# Altium project Ultrasonic extern.PrjPcb
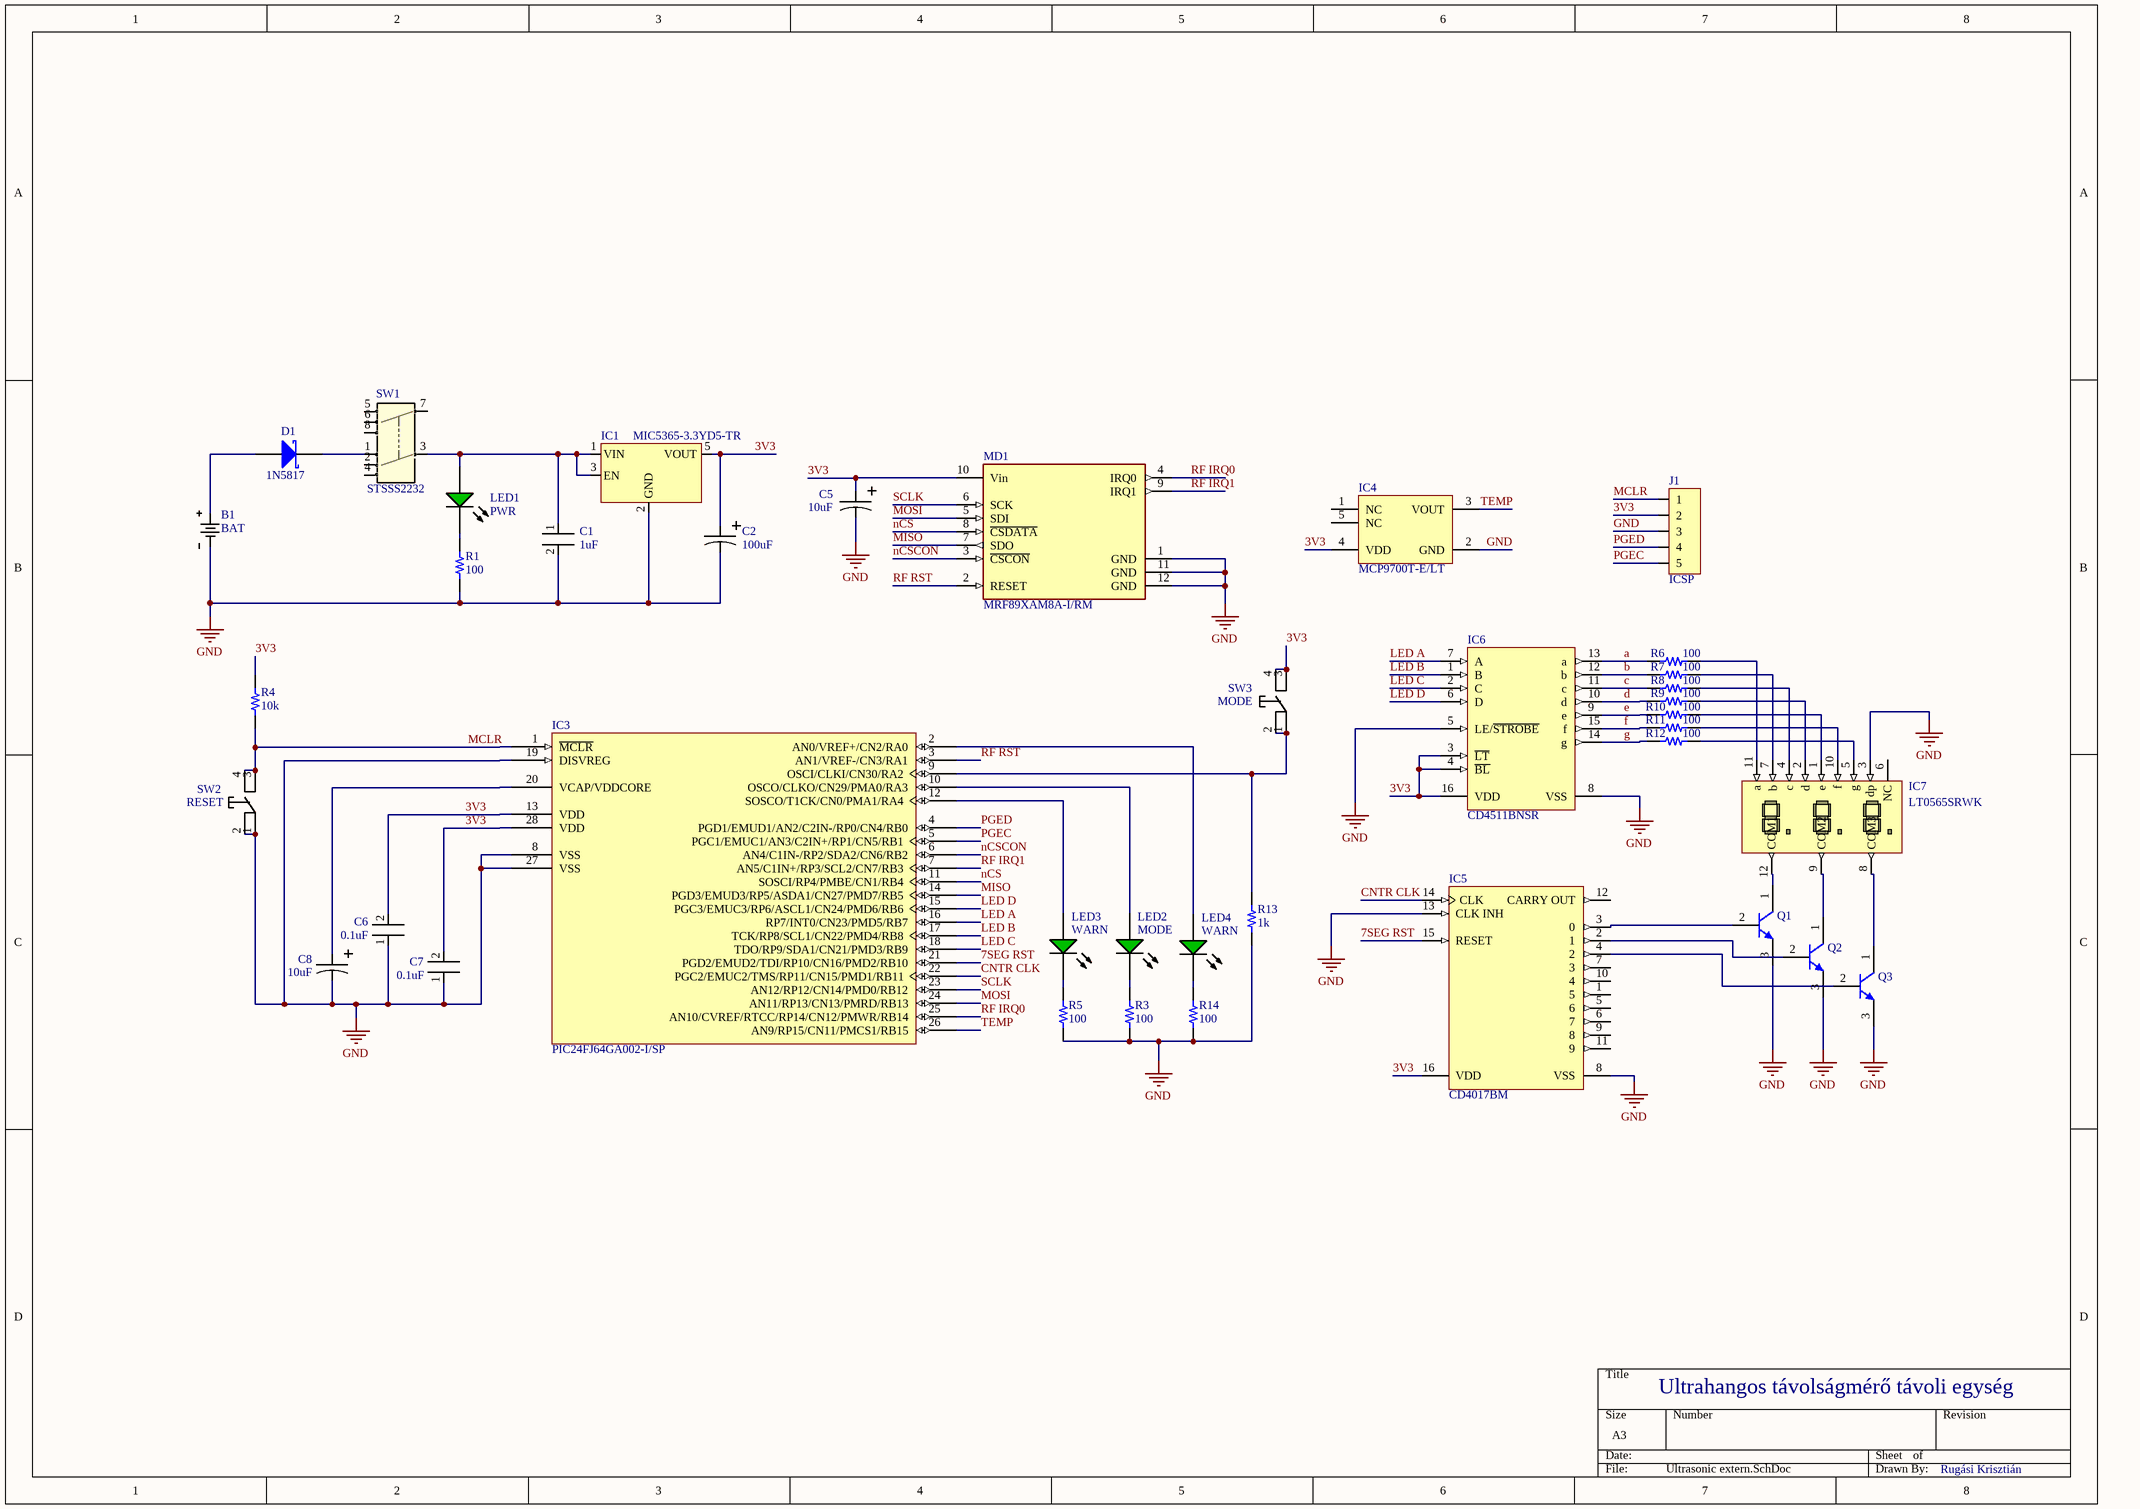
[diagram p0: Ultrasonic extern.SchDoc]
1 sheet, 39 parts. Net scope: global (net labels, ports and power ports of the same name join across sheets).
Board file: Ultrasonic extern.PcbDoc

## Sheet Ultrasonic extern.SchDoc: Ultrahangos távolságmérő távoli egység
size A3; Author: Rugási Krisztián; Engineer: Rugási Krisztián; DocumentNumber: 2; Revision: 1; SheetNumber: 1; SheetTotal: 1

### Parts
B1  BAT  [MP000342]
C1  1uF  [1206]
C2  100uF  [THT CAP POL 5mm]
C5  10uF  [THT CAP POL 5mm]
C6  0.1uF  [1206]
C7  0.1uF  [1206]
C8  10uF  [THT CAP POL 5mm]
D1  1N5817  [DIOD-DO-41-P-2]
IC1  MIC5365-3.3YD5-TR  [TSOT-23-5]
IC3  PIC24FJ64GA002-I/SP  [SPDIP300-SP28]
IC4  MCP9700T-E/LT  [SC70-LT5_M]
IC5  CD4017BM  [D0016A_N]
IC6  CD4511BNSR  [NS0016A_L]
IC7  LT0565SRWK  [7 segment LED display]
J1  ICSP  [5 PIN CON]
LED1  PWR  [LED-2P-2.54-3MM_V]
LED2  MODE  [LED-2P-2.54-3MM_V]
LED3  WARN  [LED-2P-2.54-3MM_V]
LED4  WARN  [LED-2P-2.54-3MM_V]
MD1  MRF89XAM8A-I/RM  [FP-MRF89XAM8A-I-RM-0]
Q1  BC548CG  [ONSC-TO-92-3-29-11]  (value not drawn)
Q2  BC548CG  [ONSC-TO-92-3-29-11]  (value not drawn)
Q3  BC548CG  [ONSC-TO-92-3-29-11]  (value not drawn)
R1  100  [RES 1206_3216]
R3  100  [RES 1206_3216]
R4  10k  [RES 1206_3216]
R5  100  [RES 1206_3216]
R6  100  [RES 1206_3216]
R7  100  [RES 1206_3216]
R8  100  [RES 1206_3216]
R9  100  [RES 1206_3216]
R10  100  [RES 1206_3216]
R11  100  [RES 1206_3216]
R12  100  [RES 1206_3216]
R13  1k  [RES 1206_3216]
R14  100  [RES 1206_3216]
SW1  STSSS2232  [STSSS2232]
SW2  RESET  [FSM4JH]
SW3  MODE  [FSM4JH]

### Nets
GND: B1.1(-) C1.2 C2.2 C5.2 C6.1 C7.1 C8.2 IC1.2(GND) IC3.8(VSS) IC3.19(DISVREG) IC3.27(VSS) IC4.2(GND) IC5.8(VSS) IC5.13(CLK_INH) IC6.5(LE/~{STROBE}) IC6.8(VSS) IC7.3(dp) J1.3 MD1.1(GND) MD1.11(GND) MD1.12(GND) Q1.3(E) Q2.3(E) Q3.3(E) R1.1 R3.1 R5.1 R13.1 R14.1 SW2.1 SW2.2
3V3: C2.1 C5.1 C6.2 C7.2 IC1.5(VOUT) IC3.13(VDD) IC3.28(VDD) IC4.4(VDD) IC5.16(VDD) IC6.3(~{LT}) IC6.4(~{BL}) IC6.16(VDD) J1.2 MD1.10(Vin) R4.2 SW3.3 SW3.4
7SEG RST: IC3.21(PGD2/EMUD2/TDI/RP10/CN16/PMD2/RB10) IC5.15(RESET)
a: IC6.13(a) R6.2
b: IC6.12(b) R7.2
c: IC6.11(c) R8.2
CNTR CLK: IC3.22(PGC2/EMUC2/TMS/RP11/CN15/PMD1/RB11) IC5.14(CLK)
d: IC6.10(d) R9.2
e: IC6.9(e) R10.2
f: IC6.15(f) R11.2
g: IC6.14(g) R12.2
LED A: IC3.16(RP7/INT0/CN23/PMD5/RB7) IC6.7(A)
LED B: IC3.17(TCK/RP8/SCL1/CN22/PMD4/RB8) IC6.1(B)
LED C: IC3.18(TDO/RP9/SDA1/CN21/PMD3/RB9) IC6.2(C)
LED D: IC3.15(PGC3/EMUC3/RP6/ASCL1/CN24/PMD6/RB6) IC6.6(D)
MCLR: IC3.1(~{MCLR}) J1.1 R4.1 SW2.3 SW2.4
MISO: IC3.14(PGD3/EMUD3/RP5/ASDA1/CN27/PMD7/RB5) MD1.7(SDO)
MOSI: IC3.24(AN11/RP13/CN13/PMRD/RB13) MD1.5(SDI)
nCS: IC3.11(SOSCI/RP4/PMBE/CN1/RB4) MD1.8(~{CSDATA})
nCSCON: IC3.6(AN4/C1IN-/RP2/SDA2/CN6/RB2) MD1.3(~{CSCON})
PGEC: IC3.5(PGC1/EMUC1/AN3/C2IN+/RP1/CN5/RB1) J1.5
PGED: IC3.4(PGD1/EMUD1/AN2/C2IN-/RP0/CN4/RB0) J1.4
RF IRQ0: IC3.25(AN10/CVREF/RTCC/RP14/CN12/PMWR/RB14) MD1.4(IRQ0)
RF IRQ1: IC3.7(AN5/C1IN+/RP3/SCL2/CN7/RB3) MD1.9(IRQ1)
RF RST: IC3.3(AN1/VREF-/CN3/RA1) MD1.2(RESET)
SCLK: IC3.23(AN12/RP12/CN14/PMD0/RB12) MD1.6(SCK)
TEMP: IC3.26(AN9/RP15/CN11/PMCS1/RB15) IC4.3(VOUT)
NetB1_2: B1.2(+) D1.1(A)
NetC1_1: C1.1 IC1.1(VIN) IC1.3(EN) LED1.1(A) SW1.3
NetC8_1: C8.1 IC3.20(VCAP/VDDCORE)
NetD1_2: D1.2(K) SW1.1
NetIC3_2: IC3.2(AN0/VREF+/CN2/RA0) LED4.1(A)
NetIC3_9: IC3.9(OSCI/CLKI/CN30/RA2) R13.2 SW3.1 SW3.2
NetIC3_10: IC3.10(OSCO/CLKO/CN29/PMA0/RA3) LED2.1(A)
NetIC3_12: IC3.12(SOSCO/T1CK/CN0/PMA1/RA4) LED3.1(A)
NetIC5_2: IC5.2(1) Q2.2(B)
NetIC5_3: IC5.3(0) Q1.2(B)
NetIC5_4: IC5.4(2) Q3.2(B)
NetIC7_1: IC7.1(e) R10.1
NetIC7_2: IC7.2(d) R9.1
NetIC7_4: IC7.4(c) R8.1
NetIC7_5: IC7.5(g) R12.1
NetIC7_7: IC7.7(b) R7.1
NetIC7_8: IC7.8(COM3) Q3.1(C)
NetIC7_9: IC7.9(COM2) Q2.1(C)
NetIC7_10: IC7.10(f) R11.1
NetIC7_11: IC7.11(a) R6.1
NetIC7_12: IC7.12(COM1) Q1.1(C)
NetLED1_2: LED1.2(K) R1.2
NetLED2_2: LED2.2(K) R3.2
NetLED3_2: LED3.2(K) R5.2
NetLED4_2: LED4.2(K) R14.2

Not connected (* = marked no-connect by the designer): IC4 1(NC) 5(NC); IC5 1(5) 5(6) 6(7) 7(3) 9(8) 10(4) 11(9) 12(CARRY_OUT); IC7 6(NC); SW1 2 4 5 6 7 8

### Notes on the sheet
- Ultrahangos távolságmérő távoli egység
- Rugási Krisztián

### Library data of the parts
B1 = BAT: Battery holder 3xAAA
C1 C6 C7 = CAP: Capacitor ceramic
C2 C5 C8 = CAP POL: aluminium electrolytic capacitor
D1 = CMP-2000-05521-1: Schottky Barrier Rectifier, 1 A, 20 V, -65 to 125 degC, 2-Pin DO-41, RoHS, Tape and Reel; Manufacturer: DiodesIncorporated; Vrrm - Repetitive Reverse Voltage: 20V; If - Forward Current: 1A; Configuration: Single; Unit Weight: 0.010582oz; Type: SchottkyDiode; Ifsm - Forward Surge Current: 25A; Vf - Forward Voltage: 0.75Vat3A; Ir - Reverse Current: 1000uA; Technology: Si; Length: 5.21mm; Product: SchottkyRectifiers; Package Reference: DO-41-P-2; Package / Case: DO-41; Datasheet URL: http://www.diodes.com/_files/datasheets/ds23001.pdf; Operating Temperature Range: -65Cto+125C; Mounting Style: ThroughHole; Manufacturer URL: http://www.diodes.com/; Series: 1N58; Minimum Operating Temperature: -65C; Height: 2.72mm; Brand: DiodesIncorporated; Maximum Operating Temperature: +125C; Datasheet Version: Rev. 8-2, 05/2009; Factory Pack Quantity: 5000; Width: 2.72mm; RoHS: True; Product Category: SchottkyDiodes&Rectifiers; Package Description: 2-Pin Through Hole Device, Body 4.635 x 2.36 mm, Pin Spacing 7.85 mm; Packaging: Reel; Termination Style: ThroughHole; Mounting Technology: ThroughHole
IC1 = MIC5365-3.3YD5-TR: LDO Voltage regulator 2.5V-5.5V in 3.3V out
IC3 = CMP-0046-00003-2: General Purpose 16-Bit Flash Microcontroller, 64KB Flash, 8KB SRAM, 28-Pin SPDIP, Industrial Temperature; RevisionNote: Component URLs added.; ComponentLink2URL: http://www.microchip.com/stellent/groups/techpub_sg/documents/packagingspec/en012702.pdf; ComponentLink2Description: Packaging Specification; PackageDescription: 28-Lead Skinny Plastic Dual In-Line (SP) - 300 mil Body [SPDIP]; PackageReference: SPDIP300-SP28; DatasheetVersion: revD, Feb-2010; PackageVersion: revBB, Aug-2009; ComponentLink3Description: Microchip.com Home; ComponentLink3URL: http://www.microchip.com/; ComponentLink1Description: Datasheet; ComponentLink1URL: http://ww1.microchip.com/downloads/en/DeviceDoc/39881D.pdf
IC4 = CMP-0192-00174-1: Low-Power Linear Active Thermistor IC, 5-Pin SC-70, Extended Temperature, Tape and Reel; PackageDescription: 5-Lead Plastic Small Outline Transistor (LT) [SC70]; DatasheetVersion: revE, Apr-2009; PackageVersion: revBB, Aug-2009; PackageReference: SC70-LT5; Code_IPC: SOT353-5
IC5 = CMP-1623-00071-2: CMOS Decade Counter with 10 Decoded Outputs, D0016A, TUBE; Manufacturer: Texas Instruments; Voltage(Nom)(V): 10; VCC(Min)(V): 3; tpd @ Nom Voltage(Max)(ns): 270; Technology Family: CD4000; VCC(Max)(V): 18; ICC @ Nom Voltage(Max)(mA): 0.03; Schmitt Trigger: No; Inputs: 1; Rating: Military; F @ Nom Voltage(Max)(Mhz): 8; Output Drive (IOL/IOH)(Max)(mA): 1.5/-1.5; Generic Part Number: CD4017B; DatasheetVersion: SCHS027C; Type: Decade; PackageReference: D0016A; Operating Temperature Range(C): -55 to 125; Function: Counter; Bits(#): 10; Code_JEDEC: MS-012 variation AC; Output Type: CMOS; Input Type: CMOS
IC6 = CMP-0388-00338-2: CMOS BCD-to-7-Segment LED Latch / Decoder / Driver, 3 to 18 V, -55 to 125 degC, 16-pin SOP (NS16), Green (RoHS & no Sb/Br); Manufacturer: Texas Instruments; Vin(Max)(V): 18; SubFamily: Discrete Segment LED Driver; Rating: Military; Vin(Min)(V): 3; PackageReference: NS0016A; ComponentLink1Description: Manufacturer URL; DatasheetVersion: SCHS072B; PackageVersion: 4040062/C; PackageDescription: 16-Pin Plastic Small Outline, Body 10.20 x 5.30 mm, Pitch 1.27 mm; ComponentLink2URL: http://www.ti.com/general/docs/lit/getliterature.tsp?genericPartNumber=CD4511B&fileType=pdf; Mounting Technology: Surface Mount; ComponentLink3URL: http://www.ti.com/litv/pdf/msop002a; Eco-Plan: Green (RoHS & no Sb/Br); ComponentLink3Description: Package Specification; ComponentLink2Description: Datasheet; ComponentLink1URL: http://www.ti.com/; PartNumber: CD4511BNSR
IC7 = LT0565SRWK: 7 segment LED red display, 3 digit, common cathode, 2.5V forward, 20mA
J1 = 5 PIN CON: ICSP programming pins
LED1 LED2 = CMP-2000-05186-1: Green Diffused LED, 2.1 V, 20 mA forward, -40 to 85 degC, 2-Pin THD, RoHS; Manufacturer: Avago; Viewing Angle: 50deg; Number of LEDs: 1; Lens Appearance: ColoredDiffused; Peak Wavelength: 565nm; Dominant Wavelength/Color Temperature: 569nm; Mounting Orientation: TopMount; Rad Hard: No; Lens Shape Type: Circular; Type: Uni-Color; Intensity: 2.3mcd; Package: 2T-1; Packaging: Bulk; Pin Count: 2; Color: Green; Datasheet URL: https://datasheet.ciiva.com/11773/0900766b800204ad-11773539.pdf; Manufacturer URL: http://www.avagotech.com/; Category: LEDs; Mounting: ThroughHole; Datasheet Version: Jul-14
LED3 LED4 = CMP-2000-05186-1: Red Diffused LED, 2.1 V, 20 mA forward, -40 to 85 degC, 2-Pin THD, RoHS; Manufacturer: Avago; Viewing Angle: 50deg; Number of LEDs: 1; Lens Appearance: ColoredDiffused; Color: Green; Peak Wavelength: 565nm; Dominant Wavelength/Color Temperature: 569nm; Mounting Orientation: TopMount; Rad Hard: No; Lens Shape Type: Circular; Type: Uni-Color; Intensity: 2.3mcd; Package: 2T-1; Packaging: Bulk; Pin Count: 2; Datasheet URL: https://datasheet.ciiva.com/11773/0900766b800204ad-11773539.pdf; Manufacturer URL: http://www.avagotech.com/; Category: LEDs; Mounting: ThroughHole; Datasheet Version: Jul-14
MD1 = CMP-06331-000001-1: RF TXRX MOD ISM<1GHZ TRACE ANT; Manufacturer: Microchip; Bandwidth: 7MHz; Nominal Supply Current: 1.3mA; Data Rate: 40kbits/s; Max Supply Voltage: 3.6V; Interface: SPI; Transmitting Current: 25mA; Min Supply Voltage: 2.1V; Max Frequency: 870MHz; Receiving Current: 3mA; RoHS: TRUE; Category: UNK; Device Class L2: RF Semiconductors and Devices; Height: 0.075inch; Octopart: https://octopart.com/mrf89xam8a-i%2Frm-microchip-18902547; Manufacturer Part Number: MRF89XAM8A-I/RM; Device Class L1: Integrated Circuits (ICs); Ambient Temperature Range Low: -40°C; Package: MRF89XAM8A-I/RM; Automotive: No; Ambient Temperature Range High: +85°C; ComponentLink2Description: Datasheet; Mouser Description: RF Modules 868MHz Sub-GHz transceiver module; Digikey Description: RF TXRX MOD ISM<1GHZ TRACE ANT; Temperature Range Low: -40°C; ComponentLink2URL: http://ww1.microchip.com/downloads/en/DeviceDoc/70651A.pdf; Temperature Range High: +85°C; Temperature: -40°C to +85°C; Device Class L3: Transceivers; Lead Free: Yes
Q1-Q3 = CMP-1048-01453-1: Amplifier Transistor, NPN Silicon, 3-Pin TO-92, Pb-Free, Bulk Box; Manufacturer: On Semiconductor; fT Min (MHz): 150; IC Continuous (A): 0.1; PackageReference: TO-92-3-29-11_AM_SL; RoHS: TRUE; ComponentLink2Description: Datasheet; ComponentLink3URL: http://www.onsemi.cn/pub_link/Collateral/2N6426-D.PDF; ComponentLink2URL: http://www.onsemi.com/pub_link/Collateral/BC546-D.PDF; ComponentLink3Description: Package Specification; ComponentLink1Description: Manufacturer URL; ComponentLink1URL: http://www.onsemi.com/; Polarity: NPN; DatasheetVersion: Rev. 7; PackageVersion: Rev. AM; Packing: Bulk Box; PartNumber: BC548CG; Mounting Technology: Through Hole; PackageDescription: 3-Pin Transistor Outline, Body 4.825 x 3.685 mm, Pitch 1.27 mm
R1 R3 R5-R14 = CRG1206F470R: RES SMD 470 OHM 1% 1/4W 1206; Manufacturer: TE Connectivity Passive Product; Power (Watts): 0.25W, 1/4W; Resistance: 470 Ohms; Temperature Coefficient: ±100ppm/°C; Value: 470 Ohms; Part Number: CRG1206F470R; ComponentLink1Description: Datasheet; ComponentLink1URL: https://www.te.com/commerce/DocumentDelivery/DDEController?Action=srchrtrv&DocNm=1773204&DocType=DS&DocLang=English; ComponentLink2Description: DigiKey Link; ComponentLink2URL: http://digikey.com/product-detail/en/te-connectivity-passive-product/CRG1206F470R/A106077CT-ND/3477734; Composition: Thick Film; Device Package: 1206 (3216 Metric); Height - Seated (Max): 0.026" (0.65mm); LastUpdated: 2020-09-02 01:13:10; Lifecycle Status: Active; Minimum Order: 1; Number of Terminations: 2; Operating Temperature: -55°C ~ 155°C; Package / Case: 1206 (3216 Metric); Packaging: TapeAndReel; PartId: 26990; Part Status: Active; Price: 0.01; Series: CRG, Neohm; Size / Dimension: 0.122" L x 0.061" W (3.10mm x 1.55mm); Supplier 1: DigiKey; Supplier Part Number 1: A106077CT-ND; Supplier Device Package: 1206; Tolerance: ±1%
R4 = CRG1206F10K: RES SMD 10K OHM 1% 1/4W 1206; Manufacturer: TE Connectivity Passive Product; Power (Watts): 0.25W, 1/4W; Resistance: 10 kOhms; Temperature Coefficient: ±100ppm/°C; Value: 10 kOhms; Part Number: CRG1206F10K; ComponentLink1Description: Datasheet; ComponentLink1URL: https://www.te.com/commerce/DocumentDelivery/DDEController?Action=srchrtrv&DocNm=1773204&DocType=DS&DocLang=English; ComponentLink2Description: DigiKey Link; ComponentLink2URL: http://digikey.com/product-detail/en/te-connectivity-passive-product/CRG1206F10K/A106069CT-ND/3477720; Composition: Thick Film; Device Package: 1206 (3216 Metric); Height - Seated (Max): 0.026" (0.65mm); LastUpdated: 2020-09-02 01:13:10; Lifecycle Status: Active; Minimum Order: 1; Number of Terminations: 2; Operating Temperature: -55°C ~ 155°C; Package / Case: 1206 (3216 Metric); Packaging: TapeAndReel; PartId: 26989; Part Status: Active; Price: 0.01; Series: CRG, Neohm; Size / Dimension: 0.122" L x 0.061" W (3.10mm x 1.55mm); Supplier 1: DigiKey; Supplier Part Number 1: A106069CT-ND; Supplier Device Package: 1206; Tolerance: ±1%
SW1 = STSSS2232: Sliding switch, 3-POS  DP3T, 3 A, 18 V
SW2 SW3 = SW_TACT: TACT SW, 50mA, 24V